# EAGLE design Battery-Charger-Prototype (EAGLE 6.5.0)
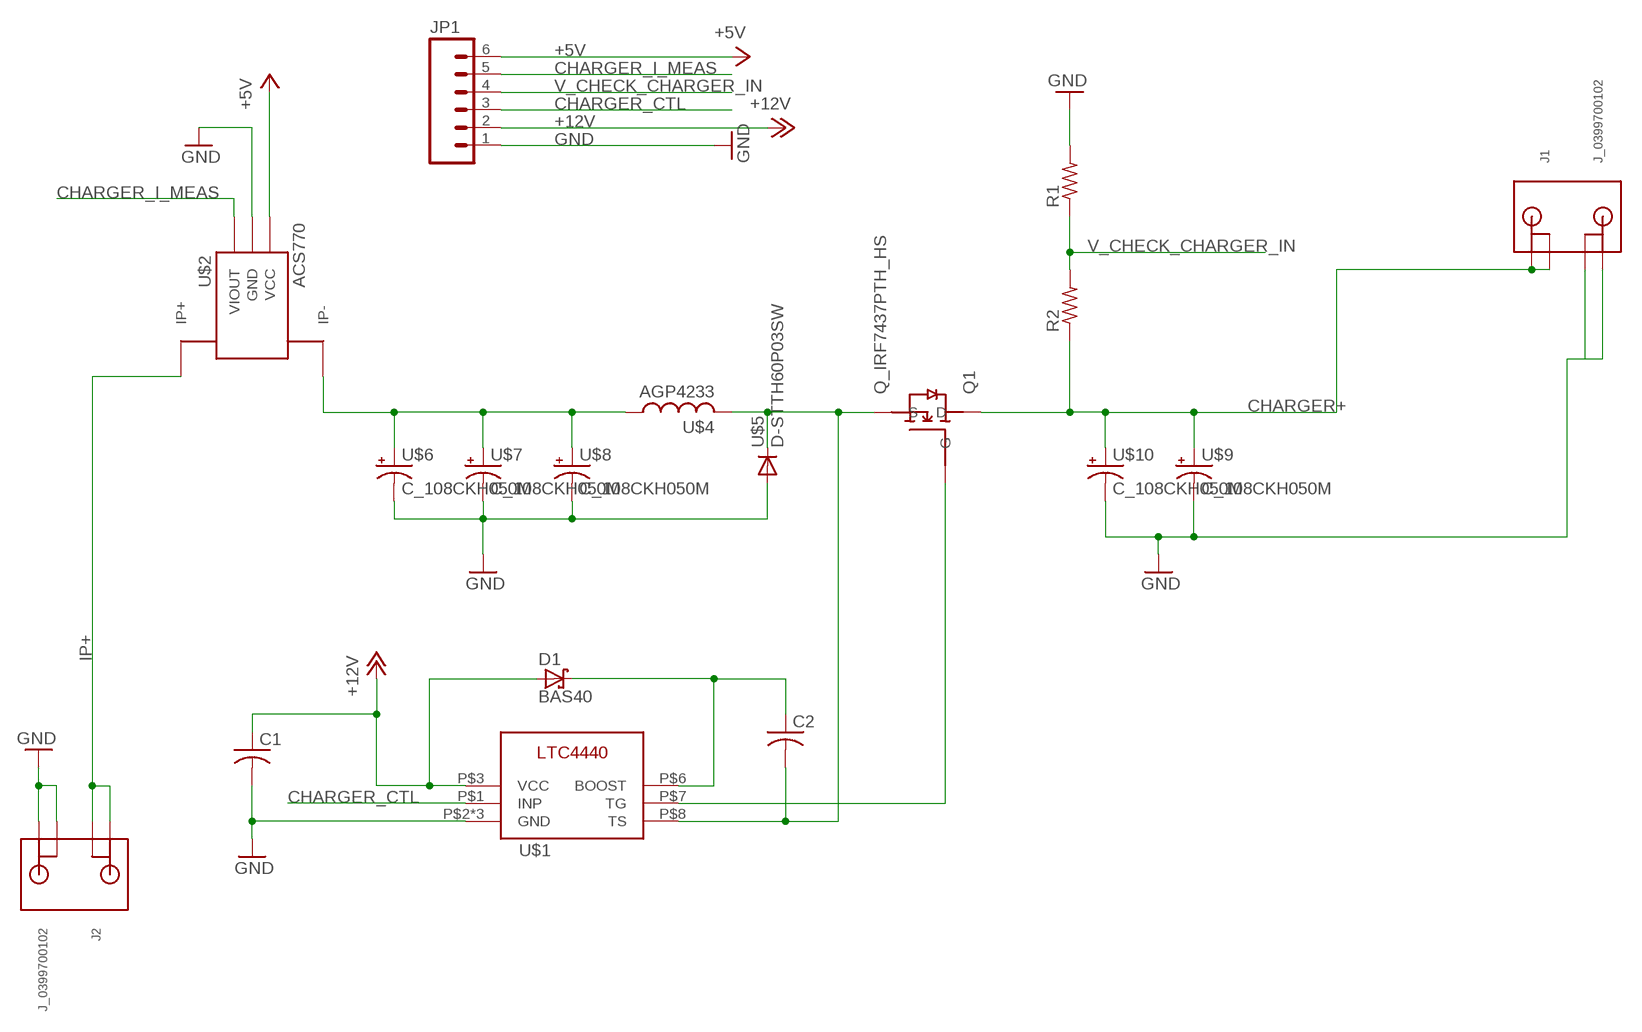
[diagram p0: schematic, sheet 1]

## Parts
C1  C-USC1206  [C1206]
C2  C-USC1206  [C1206]
D1  BAS40  [SOT23]
J1  J_0399700102  [J_2CONHC]
J2  J_0399700102  [J_2CONHC]
JP1  M06SILK_FEMALE_PTH  [1X06]
Q1  Q_IRF7437PTH_HS  [TO-220-531102B02500G]
R1  R-US_R1206  [R1206]
R2  R-US_R1206  [R1206]
U$1  LTC4440  [MS8E]
U$2  ACS770  [PFF_LEADFORM]
U$4  AGP4233  [AGP4233]
U$5  D-STTH60P03SW  [TO-247-VERT]
U$6  C_108CKH050M  [C_16MM]
U$7  C_108CKH050M  [C_16MM]
U$8  C_108CKH050M  [C_16MM]
U$9  C_108CKH050M  [C_16MM]
U$10  C_108CKH050M  [C_16MM]

## Nets
+5V: JP1.6 U$2.1(VCC)
+12V: C1.1 D1.1(A) JP1.2 U$1.P$3(VCC)
CHARGER+: J1.PIN1-1(1-1) J1.PIN1-2(1-2) Q1.2(D) R2.1 U$9.+ U$10.+
CHARGER_CTL: JP1.3 U$1.P$1(INP)
CHARGER_I_MEAS: JP1.5 U$2.3(VIOUT)
GND: C1.2 J1.PIN2-1(2-1) J1.PIN2-2(2-2) J2.PIN2-1(2-1) J2.PIN2-2(2-2) JP1.1 R1.2 U$1.P$2(GND) U$1.P$4(GND) U$1.P$9(GND) U$2.2(GND) U$5.P$1(A) U$5.P$3(A) U$6.GND(-) U$7.GND(-) U$8.GND(-) U$9.GND(-) U$10.GND(-)
IP+: J2.PIN1-1(1-1) J2.PIN1-2(1-2) U$2.4_1(IP+) U$2.4_2(IP+) U$2.4_3(IP+) U$2.4_4(IP+) U$2.4_5(IP+) U$2.4_6(IP+) U$2.4_7(IP+) U$2.4_8(IP+) U$2.4_9(IP+) U$2.4_10(IP+) U$2.4_11(IP+) U$2.4_12(IP+) U$2.4_13(IP+) U$2.4_14(IP+) U$2.4_15(IP+) U$2.4_16(IP+) U$2.4_B(IP+) U$2.4_T(IP+)
IP-: U$2.5_1(IP-) U$2.5_2(IP-) U$2.5_3(IP-) U$2.5_4(IP-) U$2.5_5(IP-) U$2.5_6(IP-) U$2.5_7(IP-) U$2.5_8(IP-) U$2.5_9(IP-) U$2.5_10(IP-) U$2.5_11(IP-) U$2.5_12(IP-) U$2.5_13(IP-) U$2.5_14(IP-) U$2.5_15(IP-) U$2.5_16(IP-) U$2.5_B(IP-) U$2.5_T(IP-) U$4.P$1 U$6.+ U$7.+ U$8.+
MOS_OUT: C2.2 Q1.3(S) U$1.P$8(TS) U$4.P$2 U$5.P$2(C)
N$4: C2.1 D1.3(C) U$1.P$6(BOOST)
N$5: Q1.1(G) U$1.P$7(TG)
V_CHECK_CHARGER_IN: JP1.4 R1.1 R2.2

## Library data of the parts
C1 C2 = rcl:C-US: CAPACITOR, American symbol
D1 = diode:BAS40: Silicon Schottky Diodes General-purpose diode for high-speed switching
J1 J2 = MRDT-2014-All:J_0399700102: High Current Power Connector
JP1 = SparkFun-Connectors:M06: Header 6 Standard 6-pin 0.1" header. Use with straight break away headers (SKU : PRT-00116), right angle break away headers (PRT-00553), swiss pins (PRT-00743), machine pins (PRT-00117), and female headers (PRT-00115). Molex polarized connector foot print use with SKU : PRT-08094 with associated crimp pins and housings. NOTES ON THE VARIANTS LOCK and LOCK_LONGPADS... This footprint was designed to help hold the alignment of a through-hole component (i.e. 6-pin header) while soldering it into place. You may notice that each hole has been shifted either up or down by 0.005 of an inch from it's more standard position (which is a perfectly straight line). This slight alteration caused the pins (the squares in the middle) to touch the edges of the holes. Because they are alternating, it causes a "brace" to hold the component in place. 0.005 has proven to be the perfect amount of "off-center" position when using our standard breakaway headers. Although looks a little odd when you look at the bare footprint, once you have a header in there, the alteration is very hard to notice. Also,if you push a header all the way into place, it is covered up entirely on the bottom side. This idea of altering the position of holes to aid alignment will be further integrated into the Sparkfun Library for other footprints. It can help hold any component with 3 or more connection pins.; PROD_ID: CONN-08437
Q1 = MRDT-2015-PowerBoard:Q_IRF*7437: 40V 195A N-CH MOSFET switch with heatsink
R1 R2 = rcl:R-US_: RESISTOR, American symbol
U$1 = 2016PowerPackLibraries:LTC4440
U$2 = MRDT-2015-BMS (1):ACS770
U$4 = 2016PowerPackLibraries:AGP4233
U$5 = 2016PowerPackLibraries:D-STTH60P03SW
U$6-U$10 = MRDT-2014-All:C_108CKH050M: CAP ALUM 50V 0.1mF 1.1A ripple

## Board
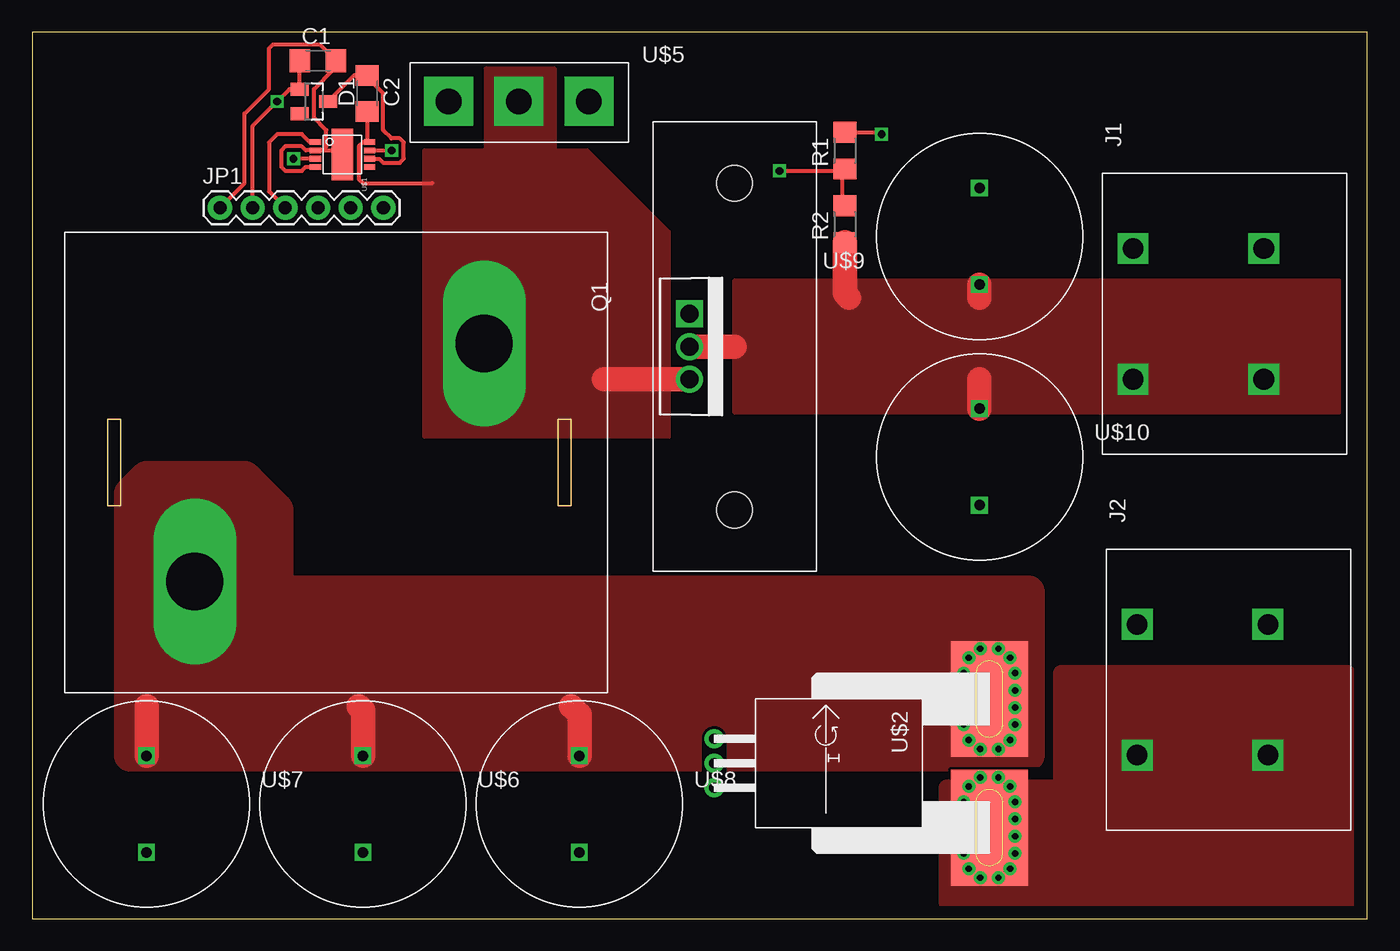
[diagram p1: board, top side]
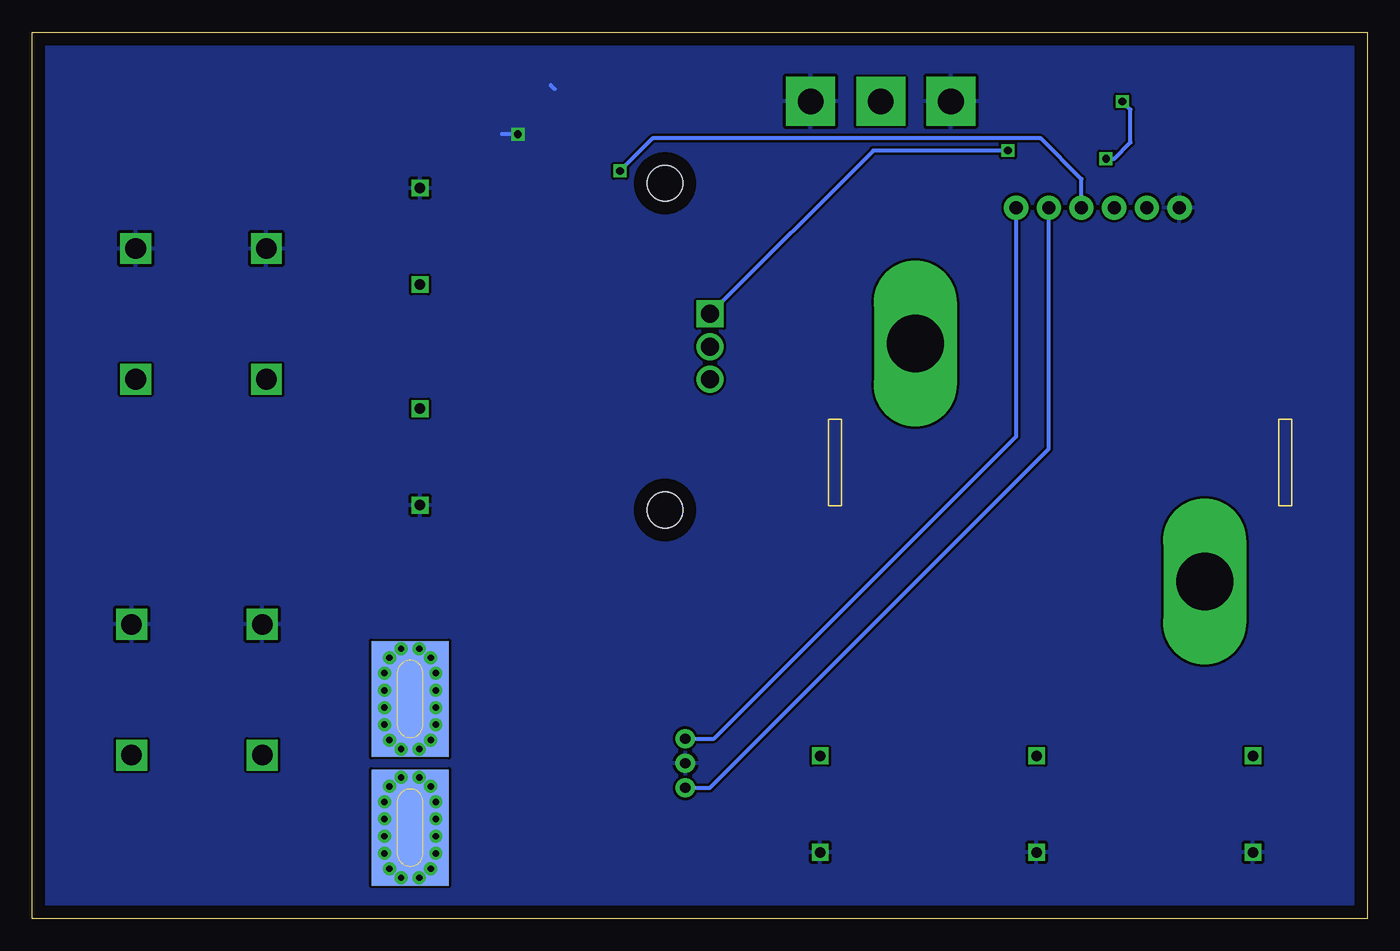
[diagram p2: board, bottom side, seen from below]

Size 103.81 x 68.89 mm. Coordinates in mm from the lower left corner, seen from the top.
Outline: 0,0 103.81,0 103.81,68.89 0,68.89 0,0
Copper layers (1*16): Top 0.035mm / dielectric 1.5mm / Bottom 0.035mm
Design rules "default": minimum track width 10mil, minimum drill 24mil, track to track 8mil, track to pad 8mil, pad to pad 8mil, via to via 8mil, smd to smd 8mil, copper to edge 40mil, drill to drill 8mil, minimum pad ring 10mil, minimum via ring 8mil, stop-mask expansion 4mil, vias tented up to drill 0mil, thermal gap 10mil

### Footprints (pad centres in the part's own frame; a part is rotated, then mirrored left to right if it is on the bottom)
C1206 = smd 1.6 x 1.8: 1 -1.4,0; 2 1.4,0
SOT23 = smd 1 x 1.4: 1 -0.95,-1.1; 2 0.95,-1.1; 3 0,1.1
J_2CONHC = drill 1.6 square: PIN1-1 -5.08,-3.05; PIN1-2 -5.08,7.11; PIN2-1 5.08,-3.05; PIN2-2 5.08,7.11
1X06 = drill 1.016 pad 1.88: 1 0,0; 2 2.54,0; 3 5.08,0; 4 7.62,0; 5 10.16,0; 6 12.7,0
TO-220-531102B02500G = drill 1.397 square: 1 -2.54,-3.507 | drill 1.397: 2 0,-3.507; 3 2.54,-3.507 | hole 2.8: -12.7,0; 12.7,0
R1206 = smd 1.6 x 1.803: 1 -1.422,0; 2 1.422,0
MS8E = smd 0.442 x 0.889: P$1 -0.975,-2.106; P$2 -0.325,-2.106; P$3 0.325,-2.106; P$4 0.975,-2.106; P$5 0.975,2.106; P$6 0.325,2.106; P$7 -0.325,2.106; P$8 -0.975,2.106 | smd 4 x 1.68: P$9 0,0
PFF_LEADFORM = drill 0.8 pad 1.5: 1 -1.91,0; 2 0,0; 3 1.91,0 | drill 0.5: 4_1 3,23.4; 4_2 4.33,23.4; 4_3 5.67,23.4; 4_4 7,23.4; 4_5 8.2,23; 4_6 8.9,22.1; 4_7 8.9,20.7; 4_8 8.2,19.8; 4_9 7,19.4; 4_10 5.67,19.4; 4_11 4.33,19.4; 4_12 3,19.4; 4_13 1.8,19.8; 4_14 1.1,20.7; 4_15 1.1,22.1; 4_16 1.8,23; 5_1 -7,23.4; 5_2 -5.67,23.4; 5_3 -4.33,23.4; 5_4 -3,23.4; 5_5 -1.8,23; 5_6 -1.1,22.1; 5_7 -1.1,20.7; 5_8 -1.8,19.8; 5_9 -3,19.4; 5_10 -4.33,19.4; 5_11 -5.67,19.4; 5_12 -7,19.4; 5_13 -8.2,19.8; 5_14 -8.9,20.7; 5_15 -8.9,22.1; 5_16 -8.2,23 | smd 9 x 6 bottom: 4_B 5,21.4; 5_B -5,21.4 | smd 9 x 6: 4_T 5,21.4; 5_T -5,21.4
AGP4233 = drill 4.45 pad 6.452 long: P$1 27.15,10.1; P$2 8.65,32.6
TO-247-VERT = drill 2 pad 3.81 square: P$1 0,0; P$2 5.45,0; P$3 10.9,0
C_16MM = drill 0.8 square: + 0,3.75; GND 0,-3.75

### Placement (x,y rotation side)
C1  22.23,66.67 0 top
C2  26.03,64.13 270 top
D1  21.91,63.5 270 top
J1  92.71,46.99 90 top
J2  93.03,17.78 90 top
JP1  14.61,55.24 0 top
Q1  54.61,44.45 270 top
R1  63.18,59.69 90 top
R2  63.18,53.97 90 top
U$1  24.13,59.37 270 top
U$2  53.02,12.07 270 top
U$4  2.54,53.34 270 top
U$5  32.38,63.5 0 top
U$6  25.72,8.89 0 top
U$7  8.89,8.89 0 top
U$8  42.55,8.89 0 top
U$9  73.66,53.02 180 top
U$10  73.66,35.88 0 top

### Tracks (layer width: path | path; a pad name or v marks a point on that pad's centre or on a via)
+5V
  Bottom 0.305: U$2.1 50.8,13.98 27.3,37.47 JP1.6
+12V  (via drill 0.6)
  Top 0.305: 20.82,64.47 D1.1 | U$1.P$3 v20.33,59.05 v20.32,59.05 | D1.1 20,64.45 v19.05,63.5 17.14,61.59 JP1.2 | D1.1 20.81,66.66 C1.1
  Bottom 0.305: v20.32,59.05 19.69,59.05 18.41,60.33 18.41,62.86 v19.05,63.5
CHARGER+
  Top 1.905: U$9.+ 73.66,48.26 | U$10.+ 73.66,41.91 | R2.1 63.18,48.58 63.5,48.26 | Q1.2 54.61,44.45
  pour Top (no thermals): 54.61,49.53 54.61,39.37 101.6,39.37 101.6,49.53
CHARGER_CTL
  Top 0.305: U$1.P$1 21.57,60.35 20.95,60.96 19.05,60.96 18.41,60.33 18.41,56.52 JP1.3
CHARGER_I_MEAS
  Bottom 0.305: U$2.3 51.12,10.16 24.77,36.51 JP1.5
GND  (via drill 0.6)
  Top 0.305: U$1.P$2 21.27,59.7 20.95,60.01 19.69,60.01 19.37,59.69 19.37,58.42 19.69,58.1 20.95,58.1 21.27,58.42 22,58.42 U$1.P$4 | R1.2 65.89,61.11 v66.04,60.96 | U$1.P$2 23.8,59.7 U$1.P$9 | U$1.P$2 22.55,59.7 22.86,60.01 22.86,61.28 21.91,62.23 21.91,64.45 23.49,66.04 23.49,66.55 C1.2 22.35,67.94 18.73,67.94 18.41,67.63 18.41,64.45 16.51,62.55 16.51,57.15 JP1.1
  Bottom 0.305: 63.18,64.45 63.5,64.77 | v66.04,60.96 67.31,60.96
  pour Bottom: 0,68.58 104.14,68.58 104.14,0 0,0
IP+
  pour Top (no thermals): 71.12,10.16 80.01,10.16 80.01,19.05 102.23,19.05 102.23,1.27 71.12,1.27
IP-
  Top 1.905: U$7.+ 8.89,16.51 | U$6.+ 25.72,16.19 25.4,16.51 | U$8.+ 42.55,15.88 41.91,16.51
  pour Top (no thermals): 19.05,25.4 77.47,25.4 77.47,12.7 7.62,12.7 7.62,33.02 8.89,34.29 16.51,34.29 19.05,31.75
MOS_OUT
  Top 0.305: C2.2 26.03,60.55 U$1.P$8 25.74,60.35 25.4,60.01 25.4,57.47 25.72,57.15 31.12,57.15
  Top 1.905: Q1.3 44.45,41.91
  pour Top (no thermals): 49.53,37.47 49.53,53.34 43.18,59.69 30.48,59.69 30.48,37.47
  pour Top (no thermals): 40.64,58.42 40.64,66.04 35.24,66.04 35.24,58.42
N$4
  Top 0.305: D1.3 25.04,65.53 C2.1 26.35,65.22 26.35,65.09 27.3,64.13 27.3,61.28 27.94,60.64 28.58,60.64 28.89,60.33 28.89,59.05 28.58,58.74 27.3,58.74 26.99,59.05 U$1.P$6
N$5  (via drill 0.6)
  Top 0.305: U$1.P$7 27.3,59.7 v27.94,59.69
  Bottom 0.305: v27.94,59.69 38.4,59.69 Q1.1
V_CHECK_CHARGER_IN  (via drill 0.6)
  Top 0.305: R2.2 63.02,55.56 63.02,58.1 | v58.1,58.1 63.02,58.1 | 63.02,58.1 R1.1
  Bottom 0.305: JP1.4 22.23,57.47 25.4,60.64 55.56,60.64 v58.1,58.1